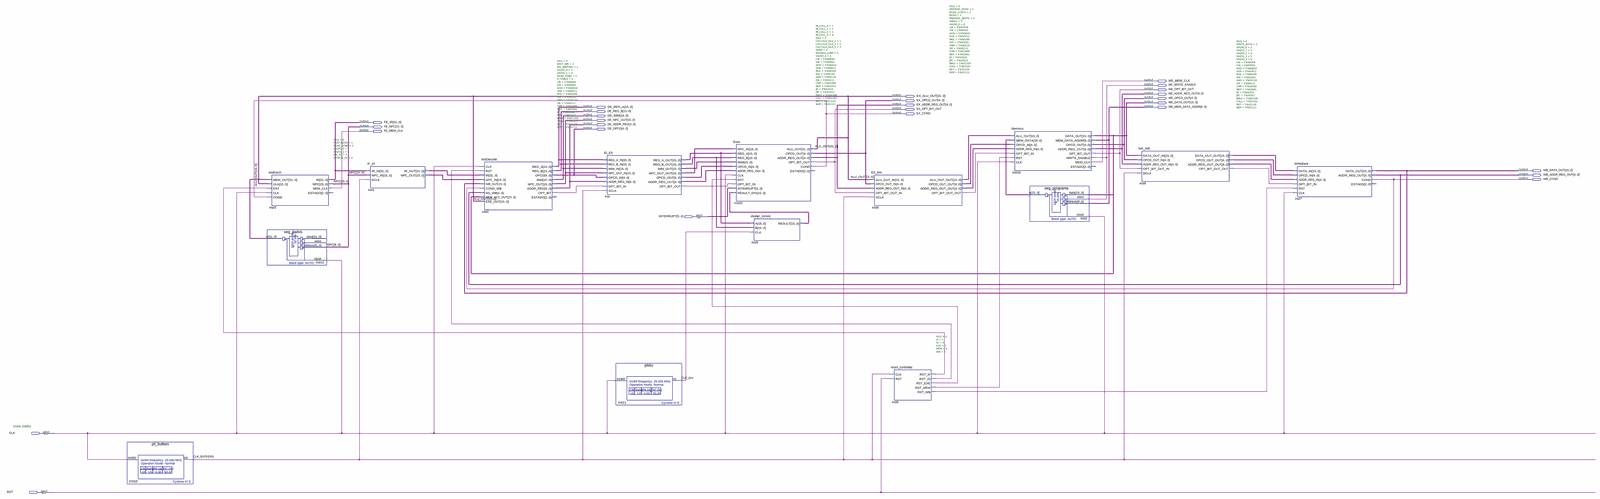
[diagram p0: schematic sheet, whole]
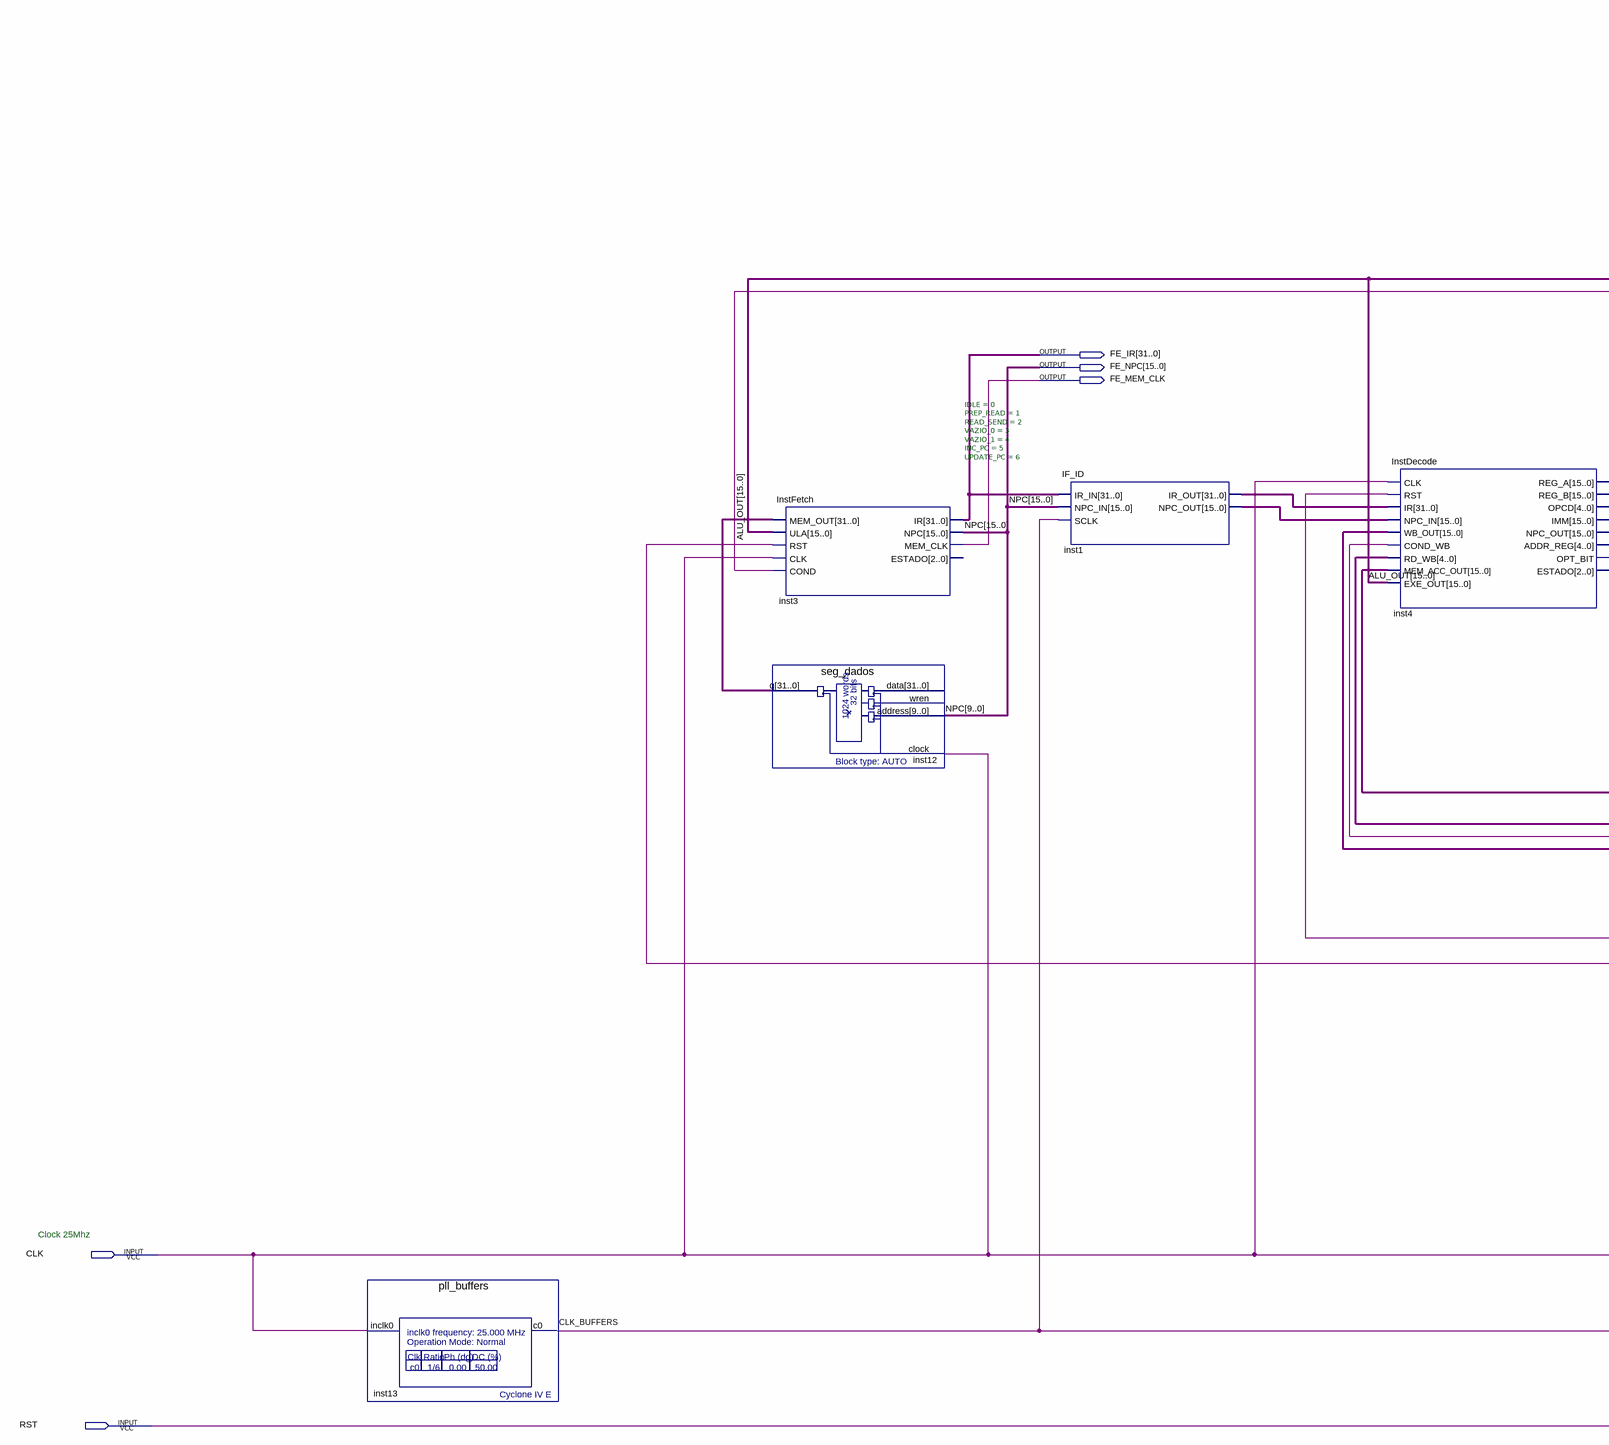
[diagram p1: schematic sheet, left part]
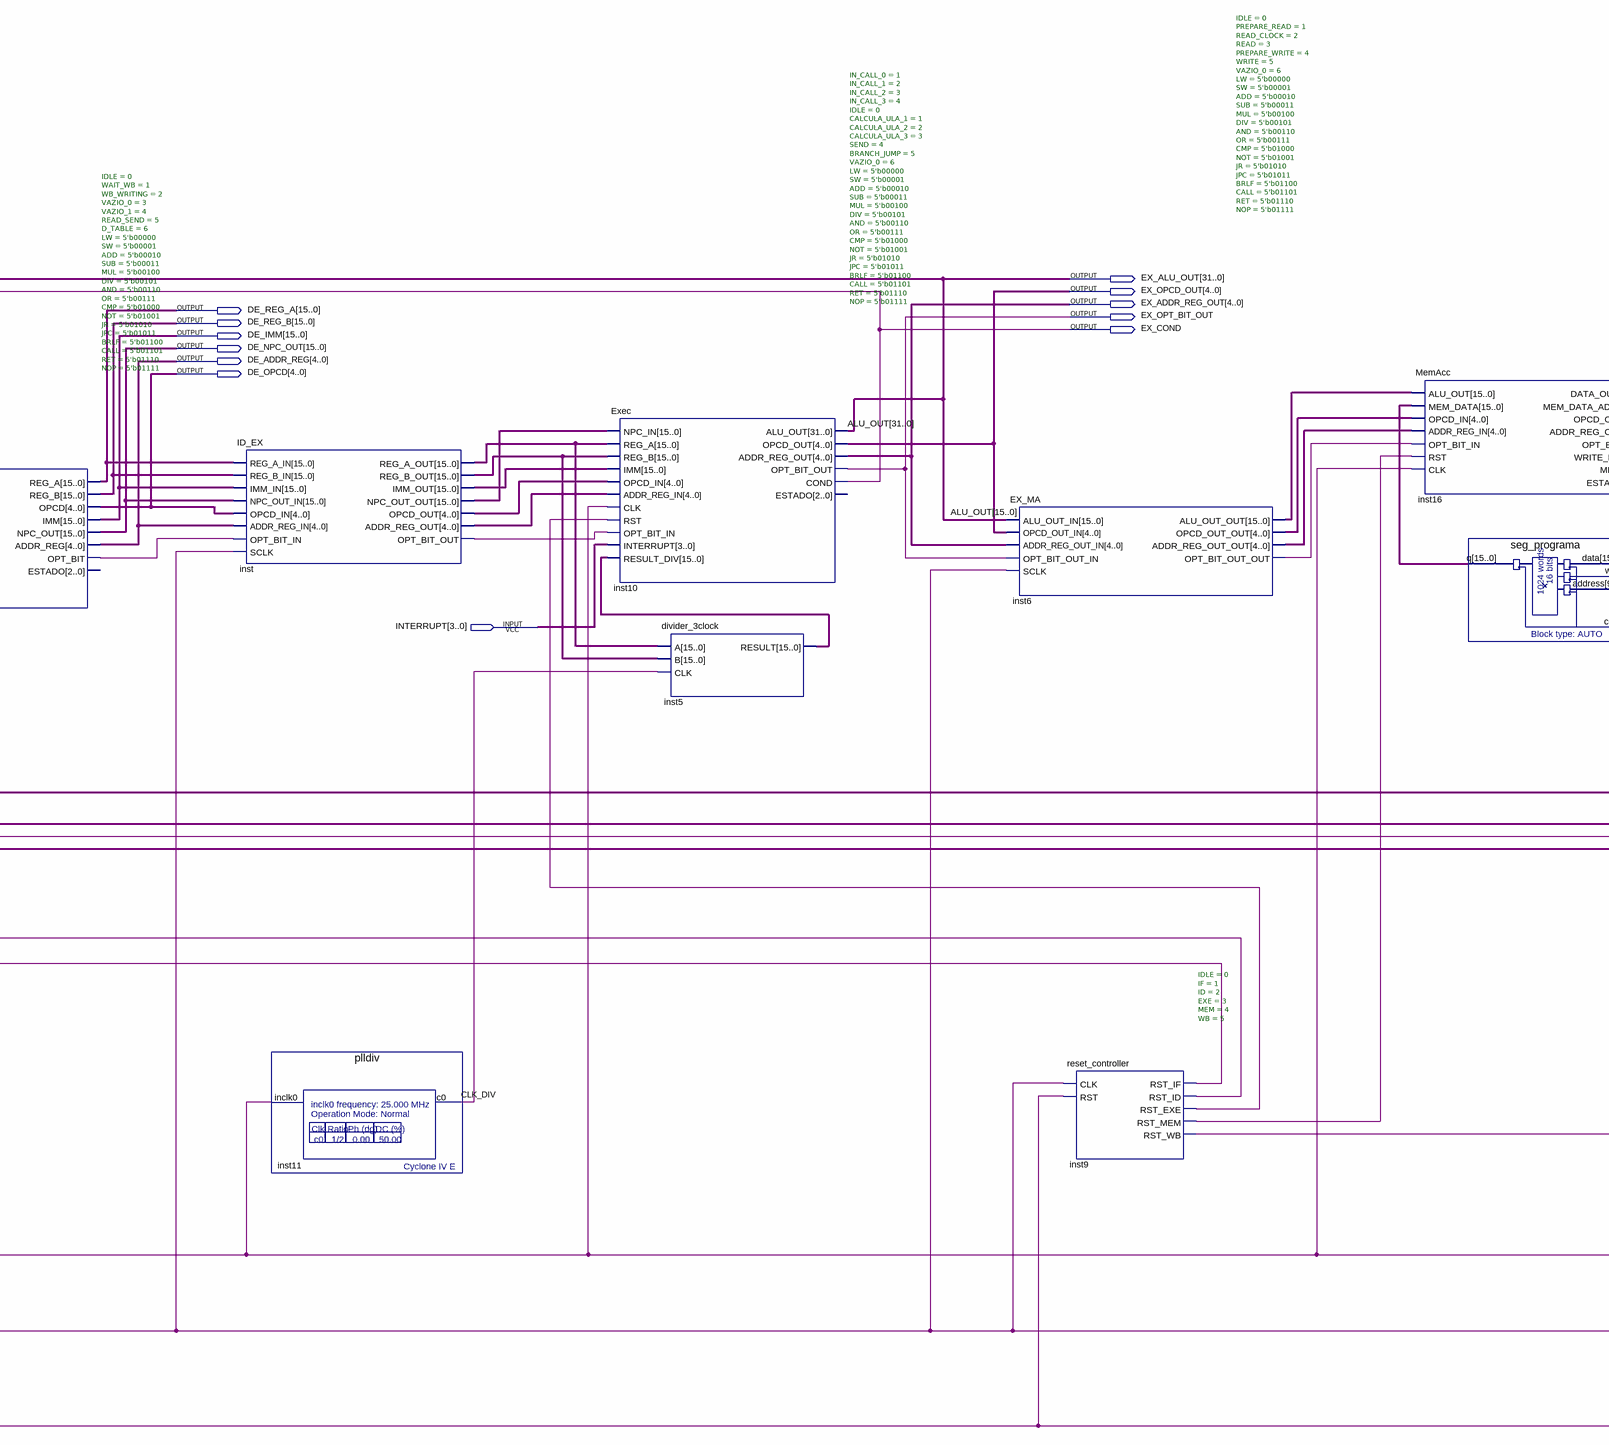
[diagram p2: schematic sheet, centre part]
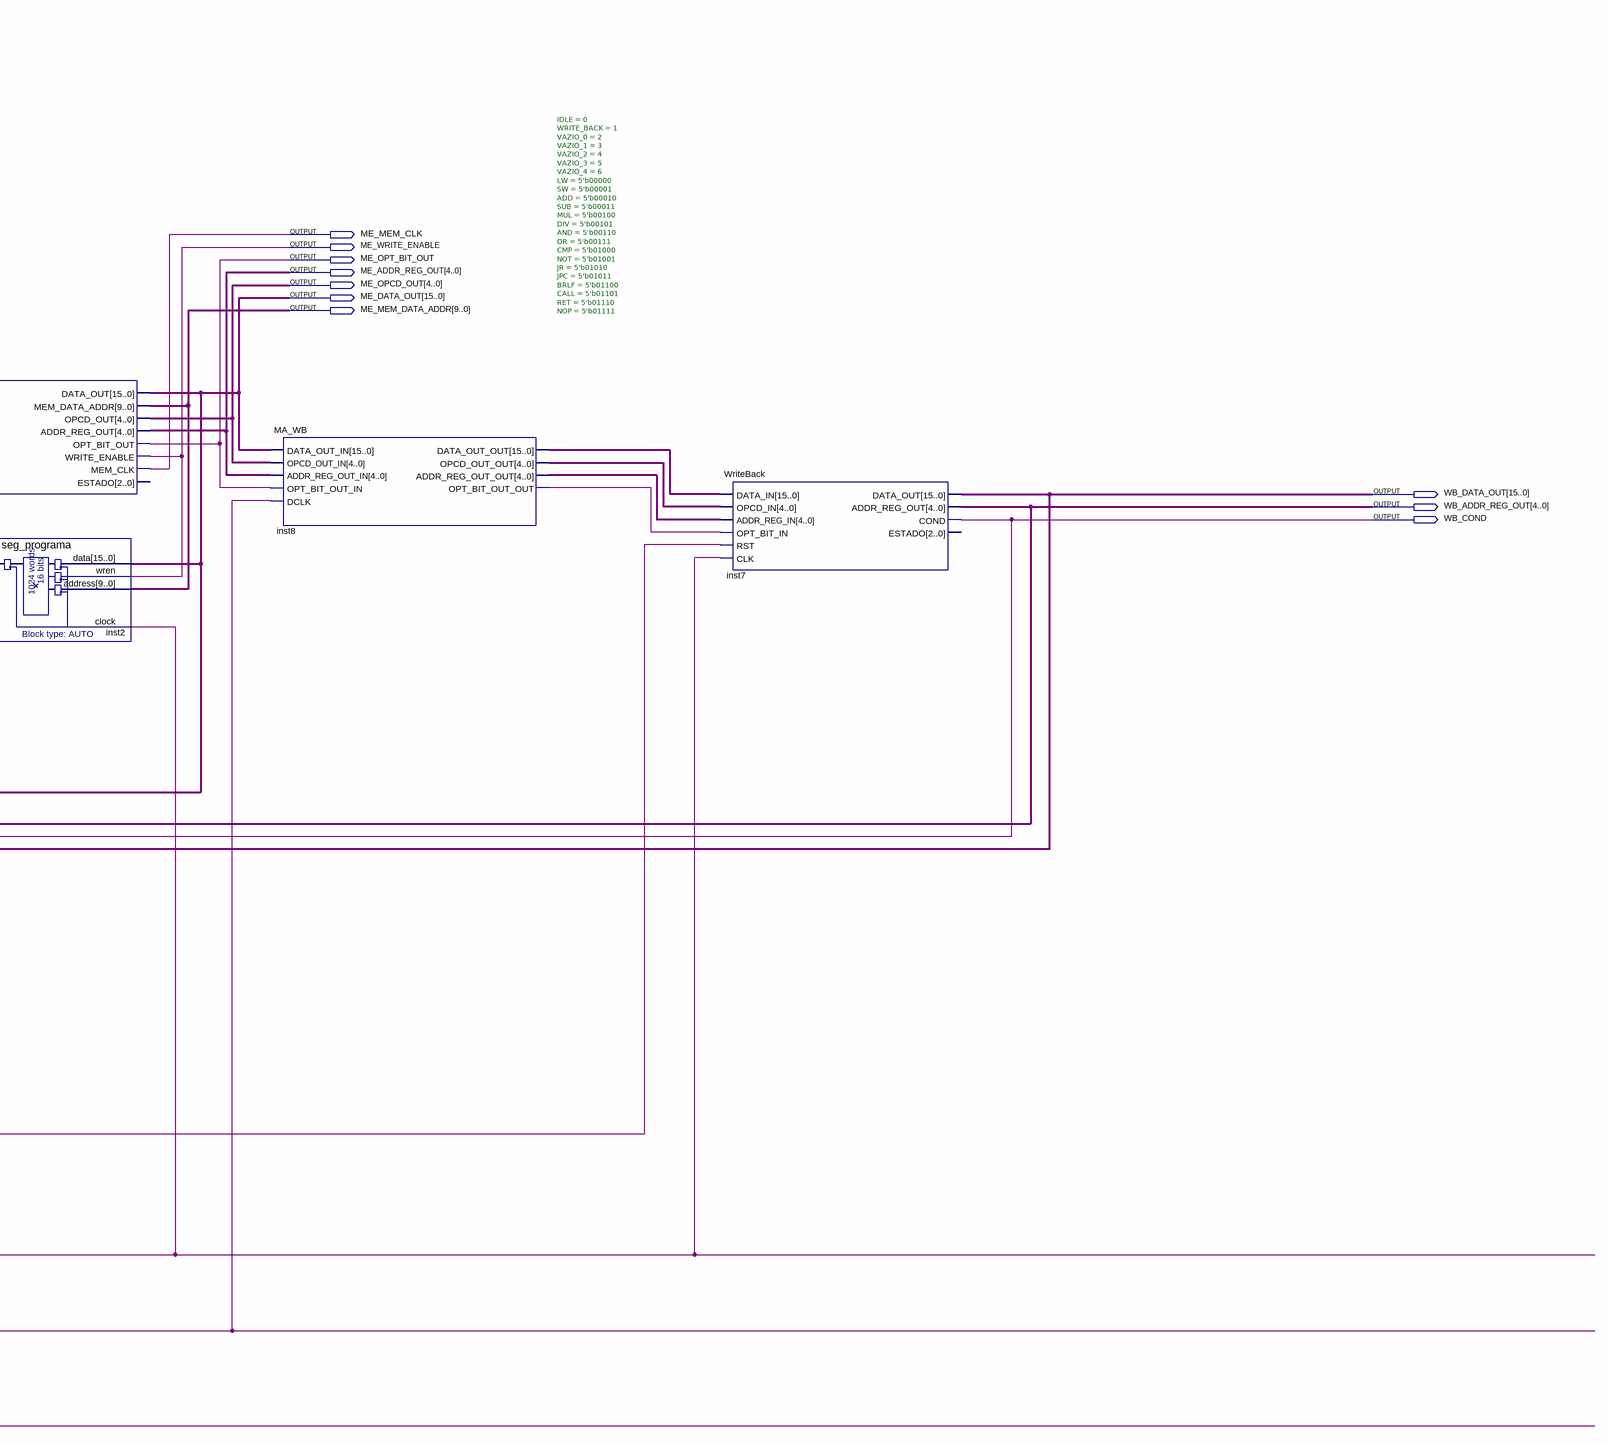
[diagram p3: schematic sheet, right part]
// Quartus schematic pipeproc.bdf as structural Verilog: 15 symbols, 27 pins
module pipeproc (
  input  [3:0] INTERRUPT,
  input  CLK,
  input  RST,
  output ME_MEM_CLK,
  output ME_WRITE_ENABLE,
  output ME_OPT_BIT_OUT,
  output [4:0] ME_ADDR_REG_OUT,
  output [31:0] EX_ALU_OUT,
  output [4:0] ME_OPCD_OUT,
  output [4:0] EX_OPCD_OUT,
  output [15:0] ME_DATA_OUT,
  output [4:0] EX_ADDR_REG_OUT,
  output [15:0] DE_REG_A,
  output [9:0] ME_MEM_DATA_ADDR,
  output EX_OPT_BIT_OUT,
  output [15:0] DE_REG_B,
  output EX_COND,
  output [15:0] DE_IMM,
  output [15:0] DE_NPC_OUT,
  output [31:0] FE_IR,
  output [4:0] DE_ADDR_REG,
  output [15:0] FE_NPC,
  output [4:0] DE_OPCD,
  output FE_MEM_CLK,
  output [15:0] WB_DATA_OUT,
  output [4:0] WB_ADDR_REG_OUT,
  output WB_COND
);

  wire CLK_BUFFERS, CLK_DIV, inst4_opt_bit, inst6_opt_bit_out_out, inst8_opt_bit_out_out, inst9_rst_exe,
       inst9_rst_id, inst9_rst_if, inst9_rst_mem, inst9_rst_wb, inst_opt_bit_out;
  wire [4:0] inst6_addr_reg_out_out, inst6_opcd_out_out, inst8_addr_reg_out_out, inst8_opcd_out_out,
       inst_addr_reg_out, inst_opcd_out;
  wire [15:0] inst1_npc_out, inst2_q, inst5_result, inst6_alu_out_out, inst8_data_out_out, inst_imm_out,
       inst_npc_out_out, inst_reg_a_out, inst_reg_b_out;
  wire [31:0] inst1_ir_out, inst12_q;

  pll_buffers inst13 (.inclk0(CLK), .c0(CLK_BUFFERS));
  InstFetch #(.IDLE(0), .PREP_READ(1), .READ_SEND(2), .VAZIO_0(3), .VAZIO_1(4), .INC_PC(5), .UPDATE_PC(6)) inst3 (
    .MEM_OUT(inst12_q), .ULA(EX_ALU_OUT[15:0]), .RST(inst9_rst_if), .CLK(CLK), .COND(EX_COND), .IR(FE_IR),
    .NPC(FE_NPC), .MEM_CLK(FE_MEM_CLK));  // open: ESTADO
  seg_dados inst12 (.address(FE_NPC[9:0]), .clock(CLK), .q(inst12_q));  // open: data, wren
  IF_ID inst1 (.IR_IN(FE_IR), .NPC_IN(FE_NPC), .SCLK(CLK_BUFFERS), .IR_OUT(inst1_ir_out), .NPC_OUT(inst1_npc_out));
  InstDecode #(.IDLE(0), .WAIT_WB(1), .WB_WRITING(2), .VAZIO_0(3), .VAZIO_1(4), .READ_SEND(5), .D_TABLE(6), .LW(5'b00000), .SW(5'b00001), .ADD(5'b00010), .SUB(5'b00011), .MUL(5'b00100), .DIV(5'b00101), .AND(5'b00110), .OR(5'b00111), .CMP(5'b01000), .NOT(5'b01001), .JR(5'b01010), .JPC(5'b01011), .BRLF(5'b01100), .CALL(5'b01101), .RET(5'b01110), .NOP(5'b01111)) inst4 (
    .CLK(CLK), .RST(inst9_rst_id), .IR(inst1_ir_out), .NPC_IN(inst1_npc_out), .WB_OUT(WB_DATA_OUT),
    .COND_WB(WB_COND), .RD_WB(WB_ADDR_REG_OUT), .MEM_ACC_OUT(ME_DATA_OUT), .EXE_OUT(EX_ALU_OUT[15:0]),
    .REG_A(DE_REG_A), .REG_B(DE_REG_B), .OPCD(DE_OPCD), .IMM(DE_IMM), .NPC_OUT(DE_NPC_OUT),
    .ADDR_REG(DE_ADDR_REG), .OPT_BIT(inst4_opt_bit));  // open: ESTADO
  ID_EX inst (
    .REG_A_IN(DE_REG_A), .REG_B_IN(DE_REG_B), .IMM_IN(DE_IMM), .NPC_OUT_IN(DE_NPC_OUT), .OPCD_IN(DE_OPCD),
    .ADDR_REG_IN(DE_ADDR_REG), .OPT_BIT_IN(inst4_opt_bit), .SCLK(CLK_BUFFERS), .REG_A_OUT(inst_reg_a_out),
    .REG_B_OUT(inst_reg_b_out), .IMM_OUT(inst_imm_out), .NPC_OUT_OUT(inst_npc_out_out),
    .OPCD_OUT(inst_opcd_out), .ADDR_REG_OUT(inst_addr_reg_out), .OPT_BIT_OUT(inst_opt_bit_out));
  plldiv inst11 (.inclk0(CLK), .c0(CLK_DIV));
  Exec #(.IN_CALL_0(1), .IN_CALL_1(2), .IN_CALL_2(3), .IN_CALL_3(4), .IDLE(0), .CALCULA_ULA_1(1), .CALCULA_ULA_2(2), .CALCULA_ULA_3(3), .SEND(4), .BRANCH_JUMP(5), .VAZIO_0(6), .LW(5'b00000), .SW(5'b00001), .ADD(5'b00010), .SUB(5'b00011), .MUL(5'b00100), .DIV(5'b00101), .AND(5'b00110), .OR(5'b00111), .CMP(5'b01000), .NOT(5'b01001), .JR(5'b01010), .JPC(5'b01011), .BRLF(5'b01100), .CALL(5'b01101), .RET(5'b01110), .NOP(5'b01111)) inst10 (
    .NPC_IN(inst_npc_out_out), .REG_A(inst_reg_a_out), .REG_B(inst_reg_b_out), .IMM(inst_imm_out),
    .OPCD_IN(inst_opcd_out), .ADDR_REG_IN(inst_addr_reg_out), .CLK(CLK), .RST(inst9_rst_exe),
    .OPT_BIT_IN(inst_opt_bit_out), .INTERRUPT(INTERRUPT), .RESULT_DIV(inst5_result), .ALU_OUT(EX_ALU_OUT),
    .OPCD_OUT(EX_OPCD_OUT), .ADDR_REG_OUT(EX_ADDR_REG_OUT), .OPT_BIT_OUT(EX_OPT_BIT_OUT), .COND(EX_COND));  // open: ESTADO
  divider_3clock inst5 (.A(inst_reg_a_out), .B(inst_reg_b_out), .CLK(CLK_DIV), .RESULT(inst5_result));
  EX_MA inst6 (
    .ALU_OUT_IN(EX_ALU_OUT[15:0]), .OPCD_OUT_IN(EX_OPCD_OUT), .ADDR_REG_OUT_IN(EX_ADDR_REG_OUT),
    .OPT_BIT_OUT_IN(EX_OPT_BIT_OUT), .SCLK(CLK_BUFFERS), .ALU_OUT_OUT(inst6_alu_out_out),
    .OPCD_OUT_OUT(inst6_opcd_out_out), .ADDR_REG_OUT_OUT(inst6_addr_reg_out_out),
    .OPT_BIT_OUT_OUT(inst6_opt_bit_out_out));
  reset_controller #(.IDLE(0), .IF(1), .ID(2), .EXE(3), .MEM(4), .WB(5)) inst9 (
    .CLK(CLK_BUFFERS), .RST(RST), .RST_IF(inst9_rst_if), .RST_ID(inst9_rst_id), .RST_EXE(inst9_rst_exe),
    .RST_MEM(inst9_rst_mem), .RST_WB(inst9_rst_wb));
  MemAcc #(.IDLE(0), .PREPARE_READ(1), .READ_CLOCK(2), .READ(3), .PREPARE_WRITE(4), .WRITE(5), .VAZIO_0(6), .LW(5'b00000), .SW(5'b00001), .ADD(5'b00010), .SUB(5'b00011), .MUL(5'b00100), .DIV(5'b00101), .AND(5'b00110), .OR(5'b00111), .CMP(5'b01000), .NOT(5'b01001), .JR(5'b01010), .JPC(5'b01011), .BRLF(5'b01100), .CALL(5'b01101), .RET(5'b01110), .NOP(5'b01111)) inst16 (
    .ALU_OUT(inst6_alu_out_out), .MEM_DATA(inst2_q), .OPCD_IN(inst6_opcd_out_out),
    .ADDR_REG_IN(inst6_addr_reg_out_out), .OPT_BIT_IN(inst6_opt_bit_out_out), .RST(inst9_rst_mem), .CLK(CLK),
    .DATA_OUT(ME_DATA_OUT), .MEM_DATA_ADDR(ME_MEM_DATA_ADDR), .OPCD_OUT(ME_OPCD_OUT),
    .ADDR_REG_OUT(ME_ADDR_REG_OUT), .OPT_BIT_OUT(ME_OPT_BIT_OUT), .WRITE_ENABLE(ME_WRITE_ENABLE),
    .MEM_CLK(ME_MEM_CLK));  // open: ESTADO
  seg_programa inst2 (.data(ME_DATA_OUT), .wren(ME_WRITE_ENABLE), .address(ME_MEM_DATA_ADDR), .clock(CLK), .q(inst2_q));
  MA_WB inst8 (
    .DATA_OUT_IN(ME_DATA_OUT), .OPCD_OUT_IN(ME_OPCD_OUT), .ADDR_REG_OUT_IN(ME_ADDR_REG_OUT),
    .OPT_BIT_OUT_IN(ME_OPT_BIT_OUT), .DCLK(CLK_BUFFERS), .DATA_OUT_OUT(inst8_data_out_out),
    .OPCD_OUT_OUT(inst8_opcd_out_out), .ADDR_REG_OUT_OUT(inst8_addr_reg_out_out),
    .OPT_BIT_OUT_OUT(inst8_opt_bit_out_out));
  WriteBack #(.IDLE(0), .WRITE_BACK(1), .VAZIO_0(2), .VAZIO_1(3), .VAZIO_2(4), .VAZIO_3(5), .VAZIO_4(6), .LW(5'b00000), .SW(5'b00001), .ADD(5'b00010), .SUB(5'b00011), .MUL(5'b00100), .DIV(5'b00101), .AND(5'b00110), .OR(5'b00111), .CMP(5'b01000), .NOT(5'b01001), .JR(5'b01010), .JPC(5'b01011), .BRLF(5'b01100), .CALL(5'b01101), .RET(5'b01110), .NOP(5'b01111)) inst7 (
    .DATA_IN(inst8_data_out_out), .OPCD_IN(inst8_opcd_out_out), .ADDR_REG_IN(inst8_addr_reg_out_out),
    .OPT_BIT_IN(inst8_opt_bit_out_out), .RST(inst9_rst_wb), .CLK(CLK), .DATA_OUT(WB_DATA_OUT),
    .ADDR_REG_OUT(WB_ADDR_REG_OUT), .COND(WB_COND));  // open: ESTADO

  // Other names for the same wires on the sheet: ALU_OUT[31:0] = EX_ALU_OUT; NPC[15:0] = FE_NPC

  // Notes on the sheet:
  //   Clock 25Mhz
endmodule
